# EAGLE design Relay shield (EAGLE 6.3)
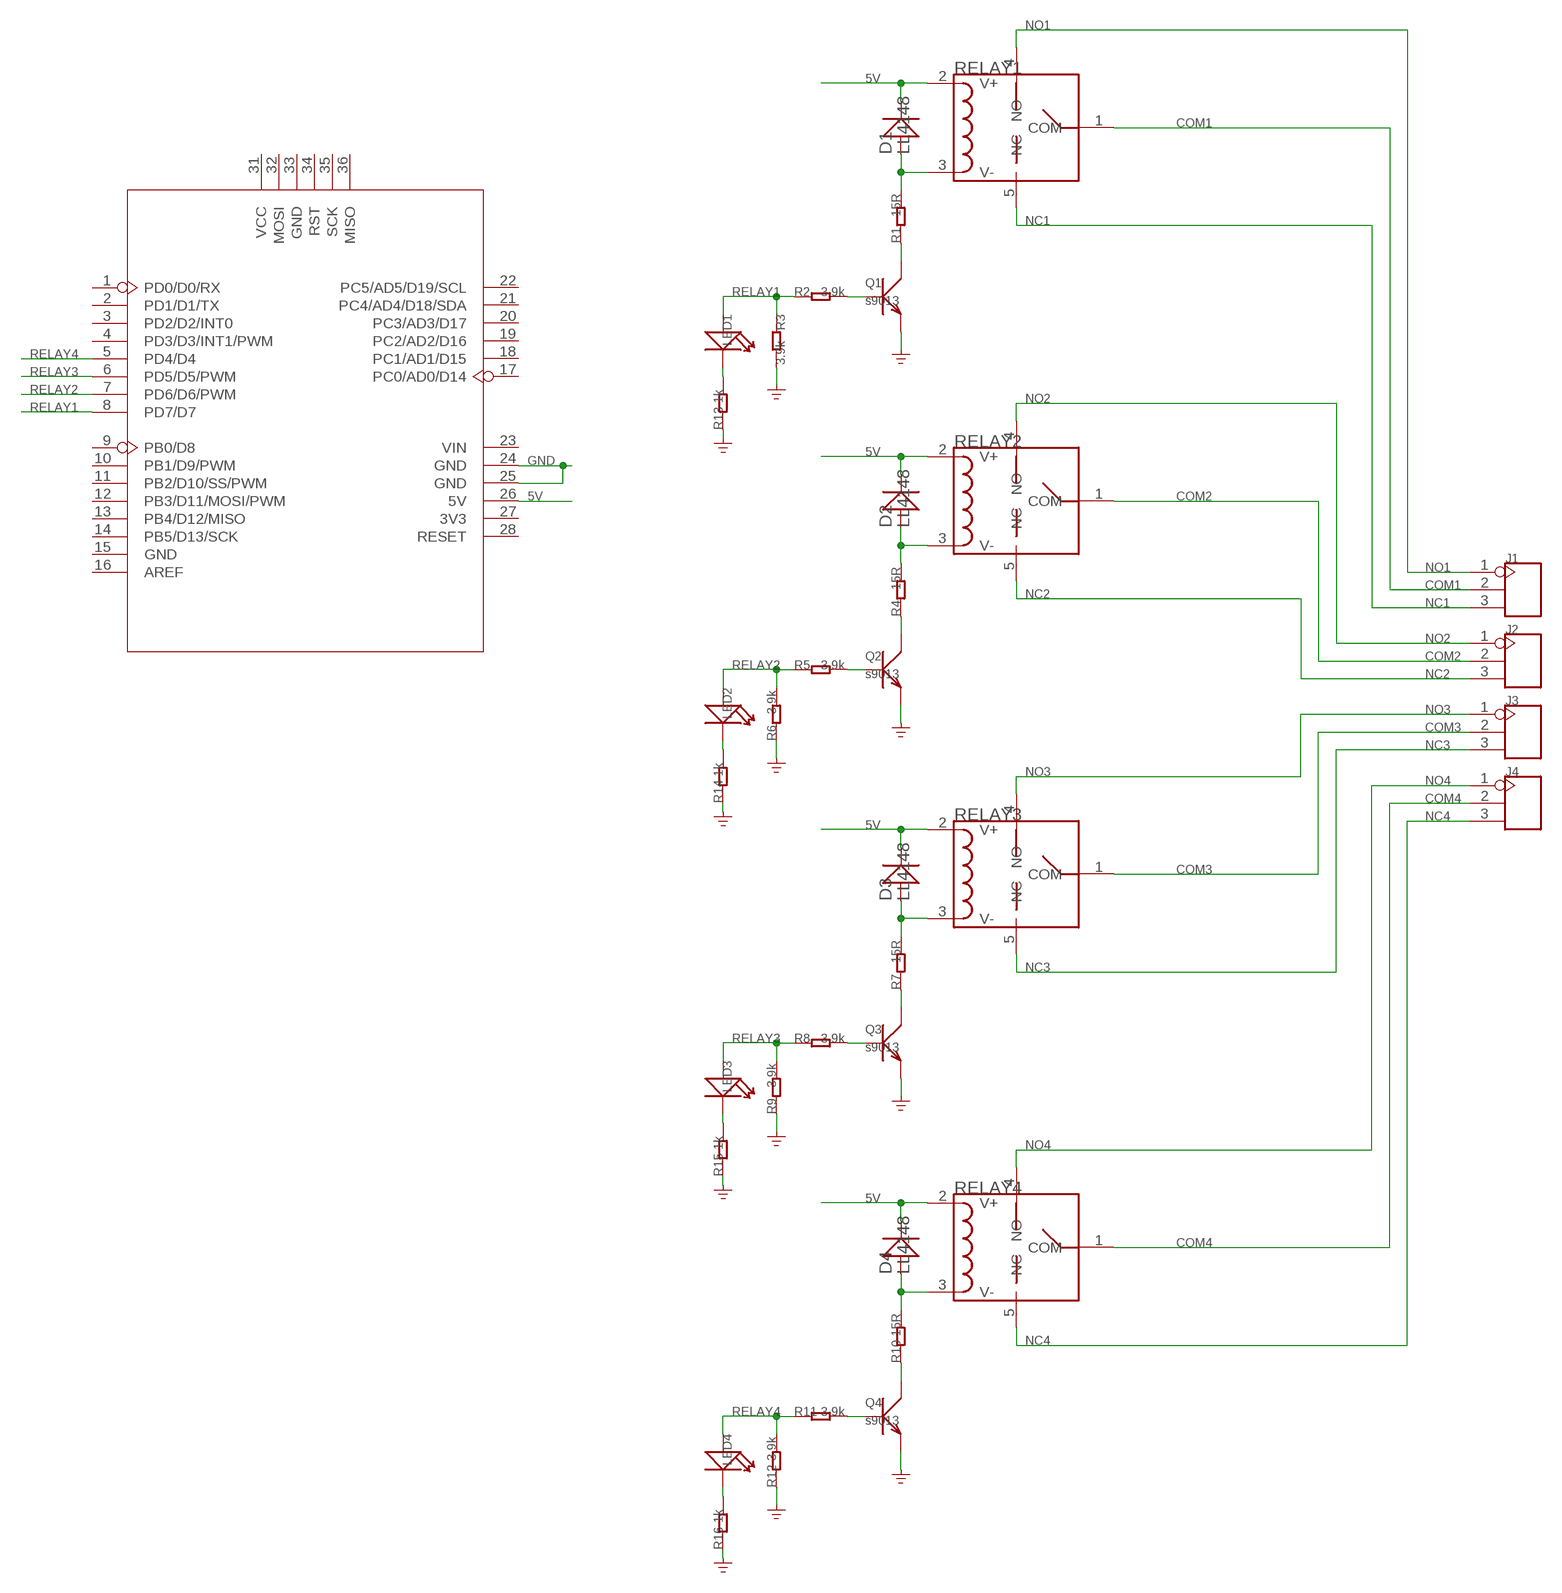
[diagram p0: schematic, sheet 1]

## Parts
D1  LL4148  D-1206  [D1206]
D2  LL4148  D-1206  [D1206]
D3  LL4148  D-1206  [D1206]
D4  LL4148  D-1206  [D1206]
J1  SCREW-TERMINAL-3P'5.08'  [3P-5.08]
J2  SCREW-TERMINAL-3P'5.08'  [3P-5.08]
J3  SCREW-TERMINAL-3P'5.08'  [3P-5.08]
J4  SCREW-TERMINAL-3P'5.08'  [3P-5.08]
LED1  LED'0603'  [LED-0603]
LED2  LED'0603'  [LED-0603]
LED3  LED'0603'  [LED-0603]
LED4  LED'0603'  [LED-0603]
Q1  s9013  TRANSISTOR-NPN-SOT23''  [SOT23]
Q2  s9013  TRANSISTOR-NPN-SOT23''  [SOT23]
Q3  s9013  TRANSISTOR-NPN-SOT23''  [SOT23]
Q4  s9013  TRANSISTOR-NPN-SOT23''  [SOT23]
R1  15R  R-0603  [R0603]
R2  3.9k  R-0603  [R0603]
R3  3.9k  R-0603  [R0603]
R4  15R  R-0603  [R0603]
R5  3.9k  R-0603  [R0603]
R6  3.9k  R-0603  [R0603]
R7  15R  R-0603  [R0603]
R8  3.9k  R-0603  [R0603]
R9  3.9k  R-0603  [R0603]
R10  15R  R-0603  [R0603]
R11  3.9k  R-0603  [R0603]
R12  3.9k  R-0603  [R0603]
R13  1k  R-0603  [R0603]
R14  1k  R-0603  [R0603]
R15  1k  R-0603  [R0603]
R16  1k  R-0603  [R0603]
RELAY1  RELAY-HLS8L-DC5V-S-C  [5P-19.0X15.5X15.8H]
RELAY2  RELAY-HLS8L-DC5V-S-C  [5P-19.0X15.5X15.8H]
RELAY3  RELAY-HLS8L-DC5V-S-C  [5P-19.0X15.5X15.8H]
RELAY4  RELAY-HLS8L-DC5V-S-C  [5P-19.0X15.5X15.8H]
U1  ARDUINO'W/O-SILK'  [ARDUINO-W/O-SILK]

## Nets
5V: D1.- D2.- D3.- D4.- RELAY1.2(V+) RELAY2.2(V+) RELAY3.2(V+) RELAY4.2(V+) U1.26(5V)
COM1: J1.2 RELAY1.1(COM)
COM2: J2.2 RELAY2.1(COM)
COM3: J3.2 RELAY3.1(COM)
COM4: J4.2 RELAY4.1(COM)
GND: Q1.2(E) Q2.2(E) Q3.2(E) Q4.2(E) R3.2 R6.1 R9.1 R12.1 R13.1 R14.1 R15.1 R16.1 U1.24(GND) U1.25(GND)
N$1: D2.+ R4.2 RELAY2.3(V-)
N$2: D3.+ R7.2 RELAY3.3(V-)
N$3: D4.+ R10.2 RELAY4.3(V-)
N$4: Q1.3(C) R1.1
N$5: Q2.3(C) R4.1
N$6: Q4.1(B) R11.2
N$7: D1.+ R1.2 RELAY1.3(V-)
N$8: Q3.3(C) R7.1
N$9: Q4.3(C) R10.1
N$11: Q3.1(B) R8.2
N$12: LED1.- R13.2
N$13: LED2.- R14.2
N$14: LED3.- R15.2
N$16: LED4.- R16.2
N$17: Q2.1(B) R5.2
N$23: Q1.1(B) R2.2
NC1: J1.3 RELAY1.5(NC)
NC2: J2.3 RELAY2.5(NC)
NC3: J3.3 RELAY3.5(NC)
NC4: J4.3 RELAY4.5(NC)
NO1: J1.1 RELAY1.4(NO)
NO2: J2.1 RELAY2.4(NO)
NO3: J3.1 RELAY3.4(NO)
NO4: J4.1 RELAY4.4(NO)
RELAY1: LED1.+ R2.1 R3.1 U1.8(PD7/D7)
RELAY2: LED2.+ R5.1 R6.2 U1.7(PD6/D6/PWM)
RELAY3: LED3.+ R8.1 R9.2 U1.6(PD5/D5/PWM)
RELAY4: LED4.+ R11.1 R12.2 U1.5(PD4/D4)
Unconnected: U1.1(PD0/D0/RX) U1.2(PD1/D1/TX) U1.3(PD2/D2/INT0) U1.4(PD3/D3/INT1/PWM) U1.9(PB0/D8) U1.10(PB1/D9/PWM) U1.11(PB2/D10/SS/PWM) U1.12(PB3/D11/MOSI/PWM) U1.13(PB4/D12/MISO) U1.14(PB5/D13/SCK) U1.15(GND) U1.16(AREF) U1.17(PC0/AD0/D14) U1.18(PC1/AD1/D15) U1.19(PC2/AD2/D16) U1.20(PC3/AD3/D17) U1.21(PC4/AD4/D18/SDA) U1.22(PC5/AD5/D19/SCL) U1.23(VIN) U1.27(3V3) U1.28(RESET) U1.31(VCC) U1.32(MOSI) U1.33(GND) U1.34(RST) U1.35(SCK) U1.36(MISO)

## Library data of the parts
D1-D4 = Discrete:D*
J1-J4 = Connector:SCREW-TERMINAL-3P
LED1-LED4 = Discrete:LED*
Q1-Q4 = Discrete:TRANSISTOR-NPN*: NPN audion
R1-R16 = Discrete:R*
RELAY1-RELAY4 = Discrete:RELAY-HLS8L-DC5V-S-C
U1 = moudle:ARDUINO

## Net classes
0 default: width 0.152 mm, drill 0.305 mm, clearance 0.152 mm

## Board
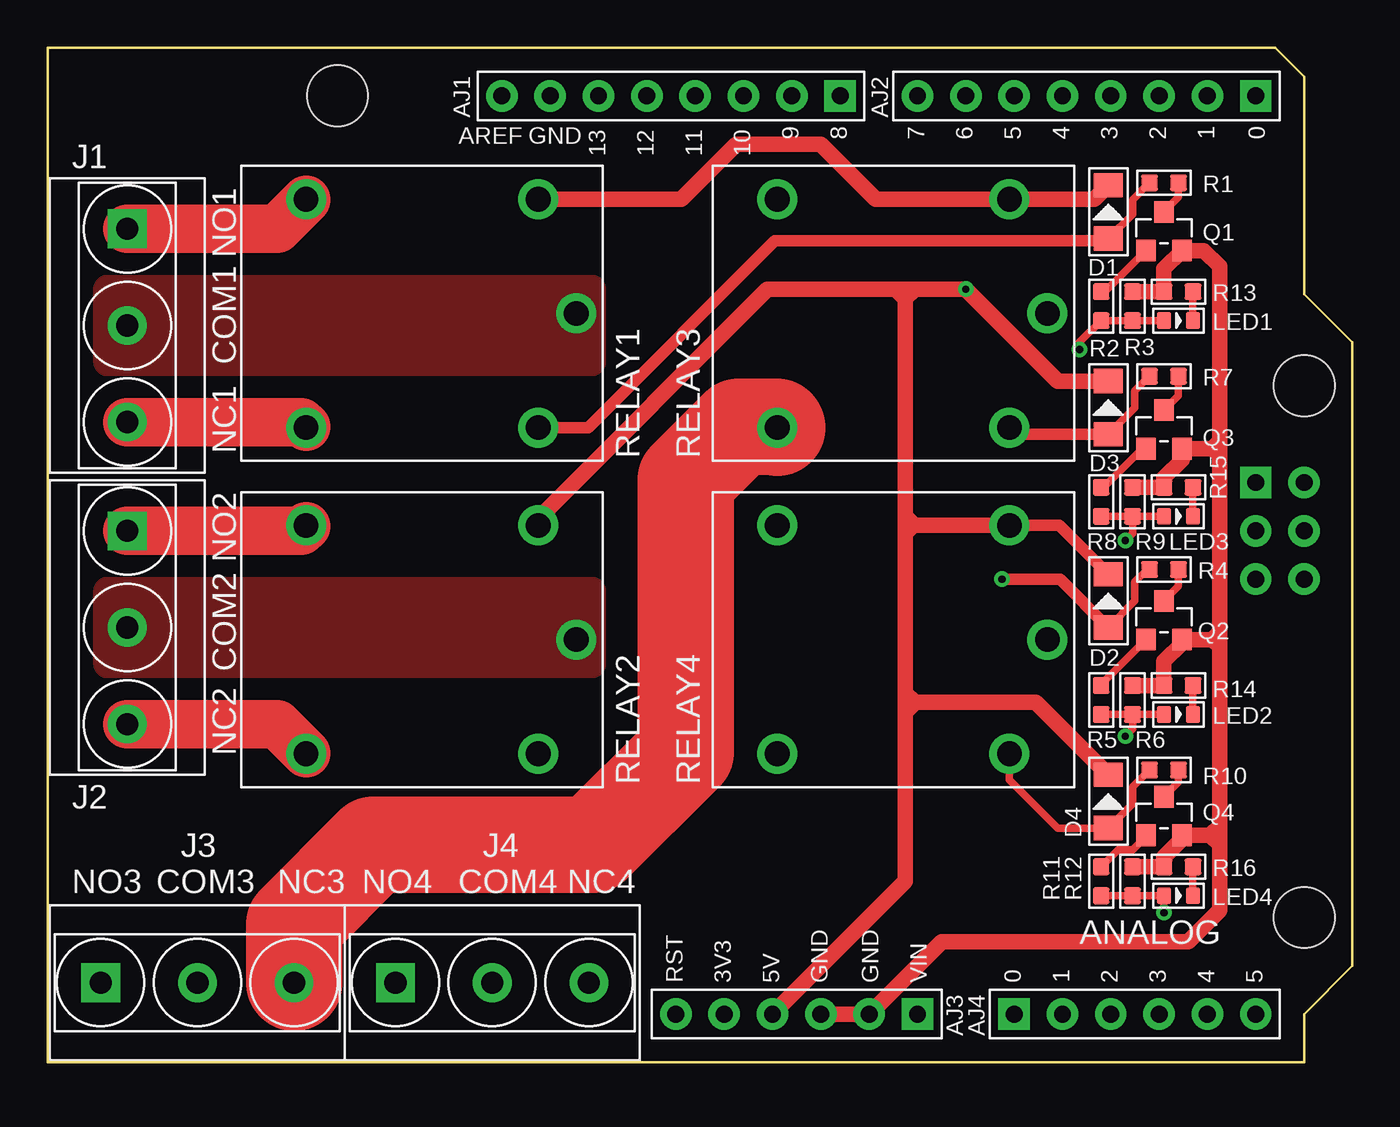
[diagram p1: board, top side]
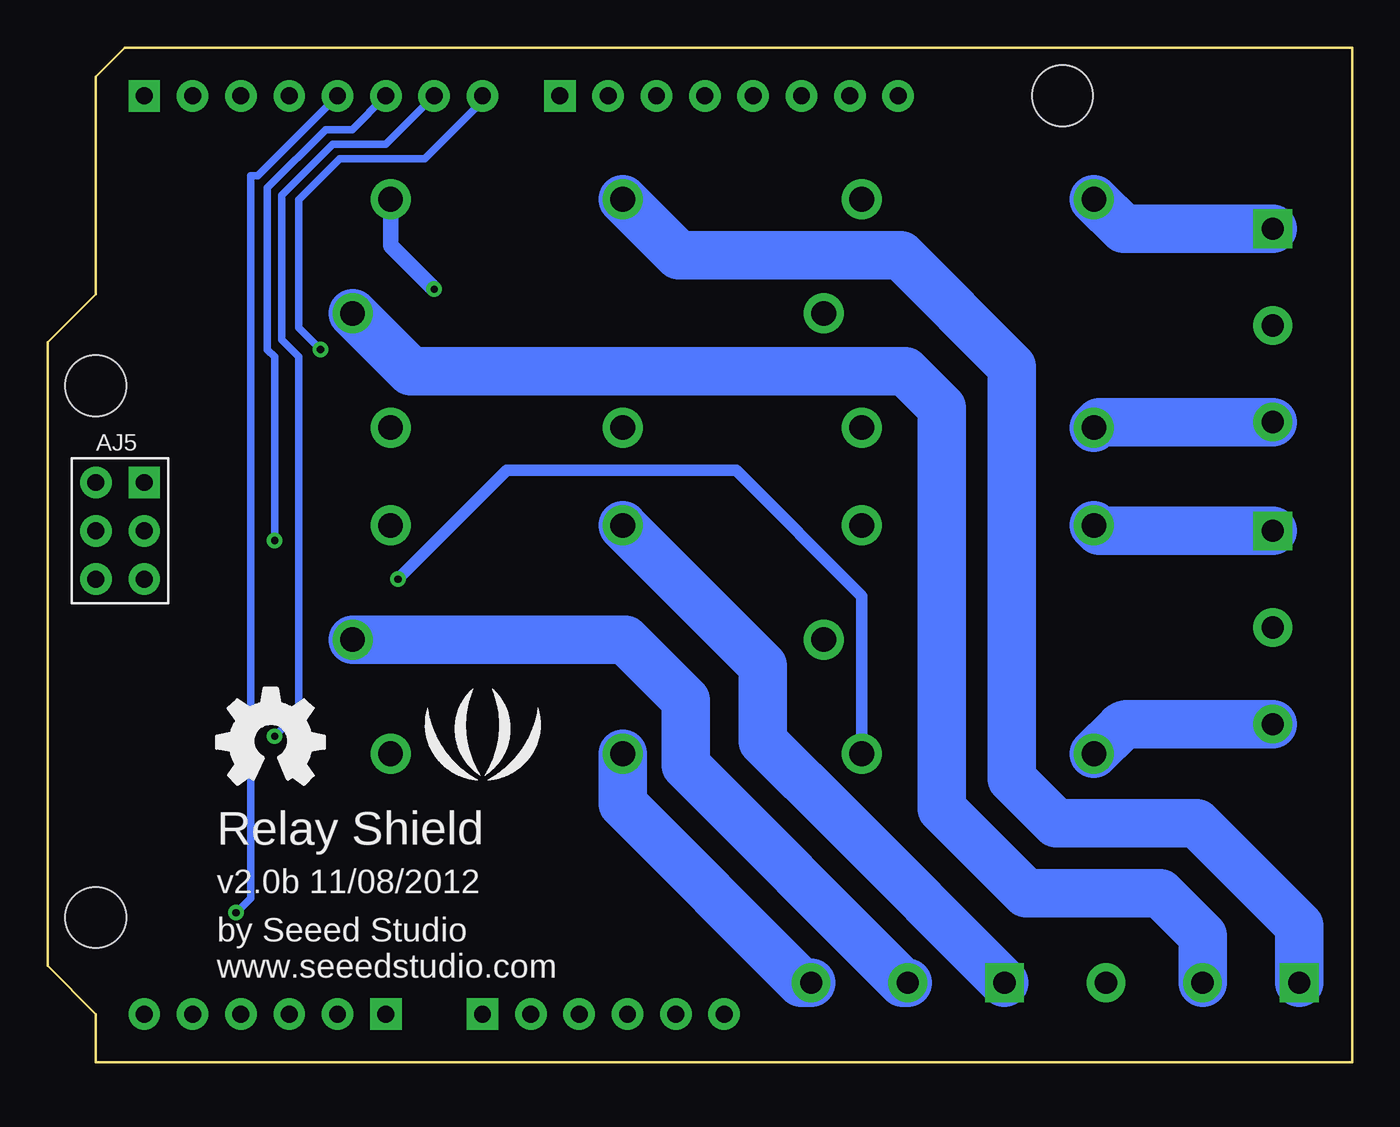
[diagram p2: board, bottom side, seen from below]

Size 68.58 x 53.34 mm. Coordinates in mm from the lower left corner, seen from the top.
Outline: 0,53.34 64.52,53.34 66.04,51.82 66.04,40.39 68.58,37.85 68.58,5.08 66.04,2.54 66.04,0 0,0 0,53.34
Copper layers (1*16): Top 0.035mm / dielectric 1.5mm / Bottom 0.035mm
Design rules "default": minimum track width 6mil, minimum drill 12mil, track to track 6mil, track to pad 6mil, pad to pad 6mil, via to via 6mil, smd to smd 0mil, copper to edge 10mil, drill to drill 10mil, minimum pad ring 10mil, minimum via ring 6mil, stop-mask expansion 2mil, vias tented up to drill 100mil, thermal gap 10mil

### Footprints (pad centres in the part's own frame; a part is rotated, then mirrored left to right if it is on the bottom)
D1206 = smd 1.27 x 1.524: + -1.397,0; - 1.397,0
3P-5.08 = drill 1.168 pad 2.032 square: 1 0,5.08 | drill 1.168 pad 2.032: 2 0,0; 3 0,-5.08
LED-0603 = smd 0.762 x 0.889: + -0.762,0; - 0.762,0
SOT23 = smd 1.016 x 1.143: 1 -0.95,-1.016; 2 0.95,-1.016; 3 0,1.016
R0603 = smd 0.889 x 0.889: 1 -0.762,0; 2 0.762,0
5P-19.0X15.5X15.8H = drill 1.3 pad 2.1: 1 -8.1,0; 2 -6.1,-6; 3 -6.1,6; 4 6.1,-6; 5 6.1,6
ARDUINO-W/O-SILK = drill 0.889 pad 1.651 square: 1 63.5,50.8; 9 41.656,50.8; 17 50.8,2.54; 23 45.72,2.54; 36 63.5,30.48 | drill 0.889 pad 1.651: 2 60.96,50.8; 3 58.42,50.8; 4 55.88,50.8; 5 53.34,50.8; 6 50.8,50.8; 7 48.26,50.8; 8 45.72,50.8; 10 39.116,50.8; 11 36.576,50.8; 12 34.036,50.8; 13 31.496,50.8; 14 28.956,50.8; 15 26.416,50.8; 16 23.876,50.8; 18 53.34,2.54; 19 55.88,2.54; 20 58.42,2.54; 21 60.96,2.54; 22 63.5,2.54; 24 43.18,2.54; 25 40.64,2.54; 26 38.1,2.54; 27 35.56,2.54; 28 33.02,2.54; 31 66.04,30.48; 32 66.04,27.94; 33 66.04,25.4; 34 63.5,25.4; 35 63.5,27.94 | hole 3.2: 15.24,50.8; 66.04,35.56; 66.04,7.62

### Placement (x,y rotation side)
D1  55.75,44.7 90 top
D2  55.75,24.26 90 top
D3  55.75,34.42 90 top
D4  55.75,13.72 90 top
J1  4.19,38.73 0 top
J2  4.19,22.86 0 top
J3  7.87,4.19 90 top
J4  23.37,4.19 90 top
LED1  59.44,38.99 0 top
LED2  59.44,18.29 0 top
LED3  59.44,28.7 0 top
LED4  59.44,8.76 0 top
Q1  58.67,43.69 0 top
Q2  58.67,23.24 0 top
Q3  58.67,33.27 0 top
Q4  58.67,12.95 0 top
R1  58.67,46.23 180 top
R2  55.37,39.75 90 top
R3  57.02,39.75 90 top
R4  58.67,25.91 180 top
R5  55.37,19.05 90 top
R6  57.02,19.05 270 top
R7  58.67,36.07 180 top
R8  55.37,29.46 90 top
R9  57.02,29.46 270 top
R10  58.67,15.37 180 top
R11  55.37,9.53 90 top
R12  57.02,9.53 270 top
R13  59.44,40.51 0 top
R14  59.44,19.81 0 top
R15  59.44,30.23 0 top
R16  59.44,10.29 0 top
RELAY1  19.68,39.37 180 top
RELAY2  19.68,22.23 180 top
RELAY3  44.45,39.37 180 top
RELAY4  44.45,22.23 180 top
U1  0,0 0 top
U$13  [LOGO_SILK]  45.72,16.51 0 bottom
U$14  [OSHW_FILLX200_NOTEXT]  59.69,14.61 0 bottom

### Tracks (layer width: path | path; a pad name or v marks a point on that pad's centre or on a via)
5V  (via drill 0.38 pad 0.81)
  Top 0.61: 55.63,35.69 D3.- | RELAY4.2 50.76,28.23 53.18,28.23 D2.-
  Top 0.813: U1.26 45.09,9.53 45.09,18.41 | 45.09,18.41 45.09,18.92 | 45.09,18.92 45.09,19.43 | 45.09,19.43 45.09,28.32 | 45.09,28.32 45.09,28.7 | 45.09,28.7 45.09,40.13 | 45.09,40.13 45.09,40.51 45.21,40.64 | 45.09,18.92 45.59,18.92 | 45.59,18.92 51.31,18.92 51.56,18.92 51.94,18.92 D4.- | 50.76,28.23 45.56,28.23 | 45.5,28.23 45.18,28.23 45.09,28.32 | D3.- 53.09,35.81 v48.26,40.64 45.59,40.64 | 44.58,40.64 37.83,40.64 25.78,28.59 RELAY2.2 | 44.58,40.64 45.21,40.64 | 45.21,40.64 45.59,40.64 | 45.09,40.13 44.58,40.64 | 45.09,40.13 45.59,40.64 | D1.- 55.02,45.37 RELAY3.2 43.53,45.37 40.64,48.26 36.2,48.26 33.3,45.37 RELAY1.2 | 45.56,28.23 45.09,28.7 | 45.56,28.23 45.5,28.23 | 45.5,28.23 45.21,27.94 | 45.59,18.92 45.09,19.43 | 45.59,18.92 45.09,18.41
  Bottom 0.813: RELAY3.2 50.55,42.93 v48.26,40.64
COM1
  pour Top (isolate 0.254, no thermals): 3.17,41.27 28.57,41.27 arc-90 29.21,40.64 29.21,36.83 arc-90 28.57,36.2 3.17,36.2 arc-90 2.54,36.83 2.54,40.64 arc-90
COM2
  pour Top (isolate 0.254, no thermals): 29.21,24.77 29.21,20.95 arc-90 28.57,20.32 3.17,20.32 arc-90 2.54,20.95 2.54,24.77 arc-90 3.17,25.4 28.57,25.4 arc-90
COM3
  Bottom 2.54: J3.2 7.87,6.65 10.11,8.89 17.14,8.89 21.59,13.34 21.59,34.42 23.5,36.32 49.5,36.32 RELAY3.1
COM4
  Bottom 2.54: RELAY4.1 38.23,22.23 35.05,19.05 35.05,15.62 23.62,4.19 J4.2
GND
  Top 0.813: R3.2 R13.1 58.67,41.72 Q1.2 60.78,42.67 61.59,41.85 61.59,32.64 | R9.1 R15.1 58.67,30.73 59.62,31.68 Q3.2 61.21,32.26 | R6.1 R14.1 58.67,21.08 59.62,22.03 Q2.2 61.21,22.23 | 61.59,32.64 61.59,32 | 61.59,32 61.59,31.88 | 61.59,31.88 61.59,22.61 | 61.59,22.61 61.59,22.35 | 61.21,22.23 61.47,22.23 61.59,22.35 | 61.21,32.26 61.34,32.26 61.59,32 | 61.59,22.35 61.59,21.84 | 61.59,21.84 61.59,12.45 | 61.59,12.45 61.59,11.94 | 61.59,11.94 61.59,11.43 | 61.59,11.43 61.59,8 59.94,6.35 46.99,6.35 U1.24 U1.25 | R12.1 R16.1 58.67,10.79 59.62,11.74 Q4.2 61.09,11.94 | 61.09,11.94 61.59,11.94 | 61.09,11.94 61.59,12.45 | 61.09,11.94 61.59,11.43 | 61.21,22.23 61.59,22.61 | 61.21,22.23 61.59,21.84 | 61.21,32.26 61.59,32.64 | 61.21,32.26 61.59,31.88
N$1  (via drill 0.38 pad 0.81)
  Top 0.406: D2.+ 57.15,24.26 57.15,25.27 57.78,25.91 R4.2
  Top 0.61: v50.16,25.4 53.21,25.4 D2.+
  Bottom 0.61: RELAY2.3 25.79,24.52 32.38,31.11 44.45,31.11 v50.16,25.4
N$2
  Top 0.406: R7.2 57.15,35.31 57.15,34.42 D3.+
  Top 0.61: RELAY3.3 50.58,33.37 50.93,33.02 D3.+
N$3
  Top 0.406: RELAY4.3 50.55,14.86 53.09,12.32 D4.+ | 56.26,12.32 D4.+ | D4.+ 57.02,13.59 57.02,14.48 R10.2
N$4
  Top 0.406: R1.1 59.44,45.47 Q1.3
N$5
  Top 0.406: R4.1 59.44,25.02 Q2.3
N$6
  Top 0.406: Q4.1 57.72,11.88 57.02,11.18 56.26,11.18 R11.2
N$7
  Top 0.406: R1.2 57.02,45.34 57.02,44.58 D1.+
  Top 0.61: RELAY1.3 28.42,33.37 38.23,43.18 55.63,43.18 D1.+
N$8
  Top 0.406: R7.1 59.44,35.05 Q3.3
N$9
  Top 0.406: R10.1 59.44,14.73 Q4.3
N$11
  Top 0.406: R8.2 55.5,30.23 57.53,32.26 Q3.1
N$12
  Top 0.406: LED1.- R13.2
N$13
  Top 0.406: LED2.- R14.2
N$14
  Top 0.406: LED3.- R15.2
N$16
  Top 0.406: LED4.- R16.2
N$17
  Top 0.406: R5.2 55.37,19.87 Q2.1
N$23
  Top 0.406: R2.2 55.56,40.51 Q1.1
NC1
  Top 2.54: J1.3 13.34,33.66 13.59,33.4
  Bottom 2.54: J1.3 13.3,33.66 RELAY1.5
NC2
  Top 2.54: J2.3 12.06,17.78 13.59,16.26
  Bottom 2.54: J2.3 11.77,17.78 arc-45 12.22,17.59 RELAY2.5
NC3
  Top 5.08: J3.3 12.95,7.27 17.11,11.43 28.66,11.43 33.53,16.3 33.53,30.61 36.32,33.4 38.32,33.4 RELAY3.5
NC4
  Bottom 2.54: RELAY4.5 38.35,13.59 28.96,4.19 J4.3
NO1
  Top 2.54: J1.1 12.06,43.81 13.59,45.34
  Bottom 2.54: J1.1 12.03,43.81 RELAY1.4
NO2
  Top 2.54: J2.1 13.34,27.94 13.59,28.19
  Bottom 2.54: J2.1 13.3,27.94 RELAY2.4
NO3
  Bottom 2.54: J3.1 2.79,7.19 8.18,12.57 15.57,12.57 17.91,14.91 17.91,36.58 23.75,42.42 35.4,42.42 RELAY3.4
NO4
  Bottom 2.54: RELAY4.4 38.32,28.19 30.99,20.86 30.99,16.89 26.8,12.7 J4.1
RELAY1  (via drill 0.38 pad 0.81)
  Top 0.406: LED1.+ R3.1 R2.1 54.23,37.85 v54.23,37.47
  Bottom 0.406: U1.8 45.72,50.55 48.77,47.5 53.21,47.5 55.37,45.34 55.37,38.61 v54.23,37.47
RELAY2  (via drill 0.38 pad 0.81)
  Top 0.406: R5.1 R6.2 | R6.2 LED2.+ | R6.2 57.02,17.53 v56.64,17.14
  Bottom 0.406: U1.7 50.8,48.26 53.58,48.26 56.26,45.58 56.26,37.97 55.37,37.08 55.37,18.41 v56.64,17.14
RELAY3  (via drill 0.38 pad 0.81)
  Top 0.406: R8.1 R9.2 | R9.2 LED3.+ | R9.2 57.02,27.81 v56.64,27.43
  Bottom 0.406: U1.6 52.58,49.02 53.97,49.02 57.02,45.97 57.02,37.47 56.64,37.08 v56.64,27.43
RELAY4  (via drill 0.38 pad 0.81)
  Top 0.406: R11.1 R12.2 LED4.+ v58.67,7.87
  Bottom 0.406: v58.67,7.87 57.91,8.64 57.91,46.61 57.53,46.61 U1.5

### Text on the board
tPlace: AJ1 | AJ2 | 9 | 8 | 7 | 6 | 5 | 4 | 3 | 2 | 1 | 0 | AREF | GND | 13 | 12 | 11 | 10 | NO1 | COM1 | NC1 | NO2 | COM2 | NC2 | NO3 | COM3 | NC3 | NO4 | COM4 | NC4 | ANALOG | RST | 3V3 | 5V | GND | GND | VIN | 0 | 1 | 2 | 3 | 4 | 5 | AJ3 | AJ4
bPlace: AJ5 | Relay Shield | v2.0b 11/08/2012 | by Seeed Studio | www.seeedstudio.com